# EAGLE design gps-breakout-mk-1.2 (EAGLE 7.5.0)
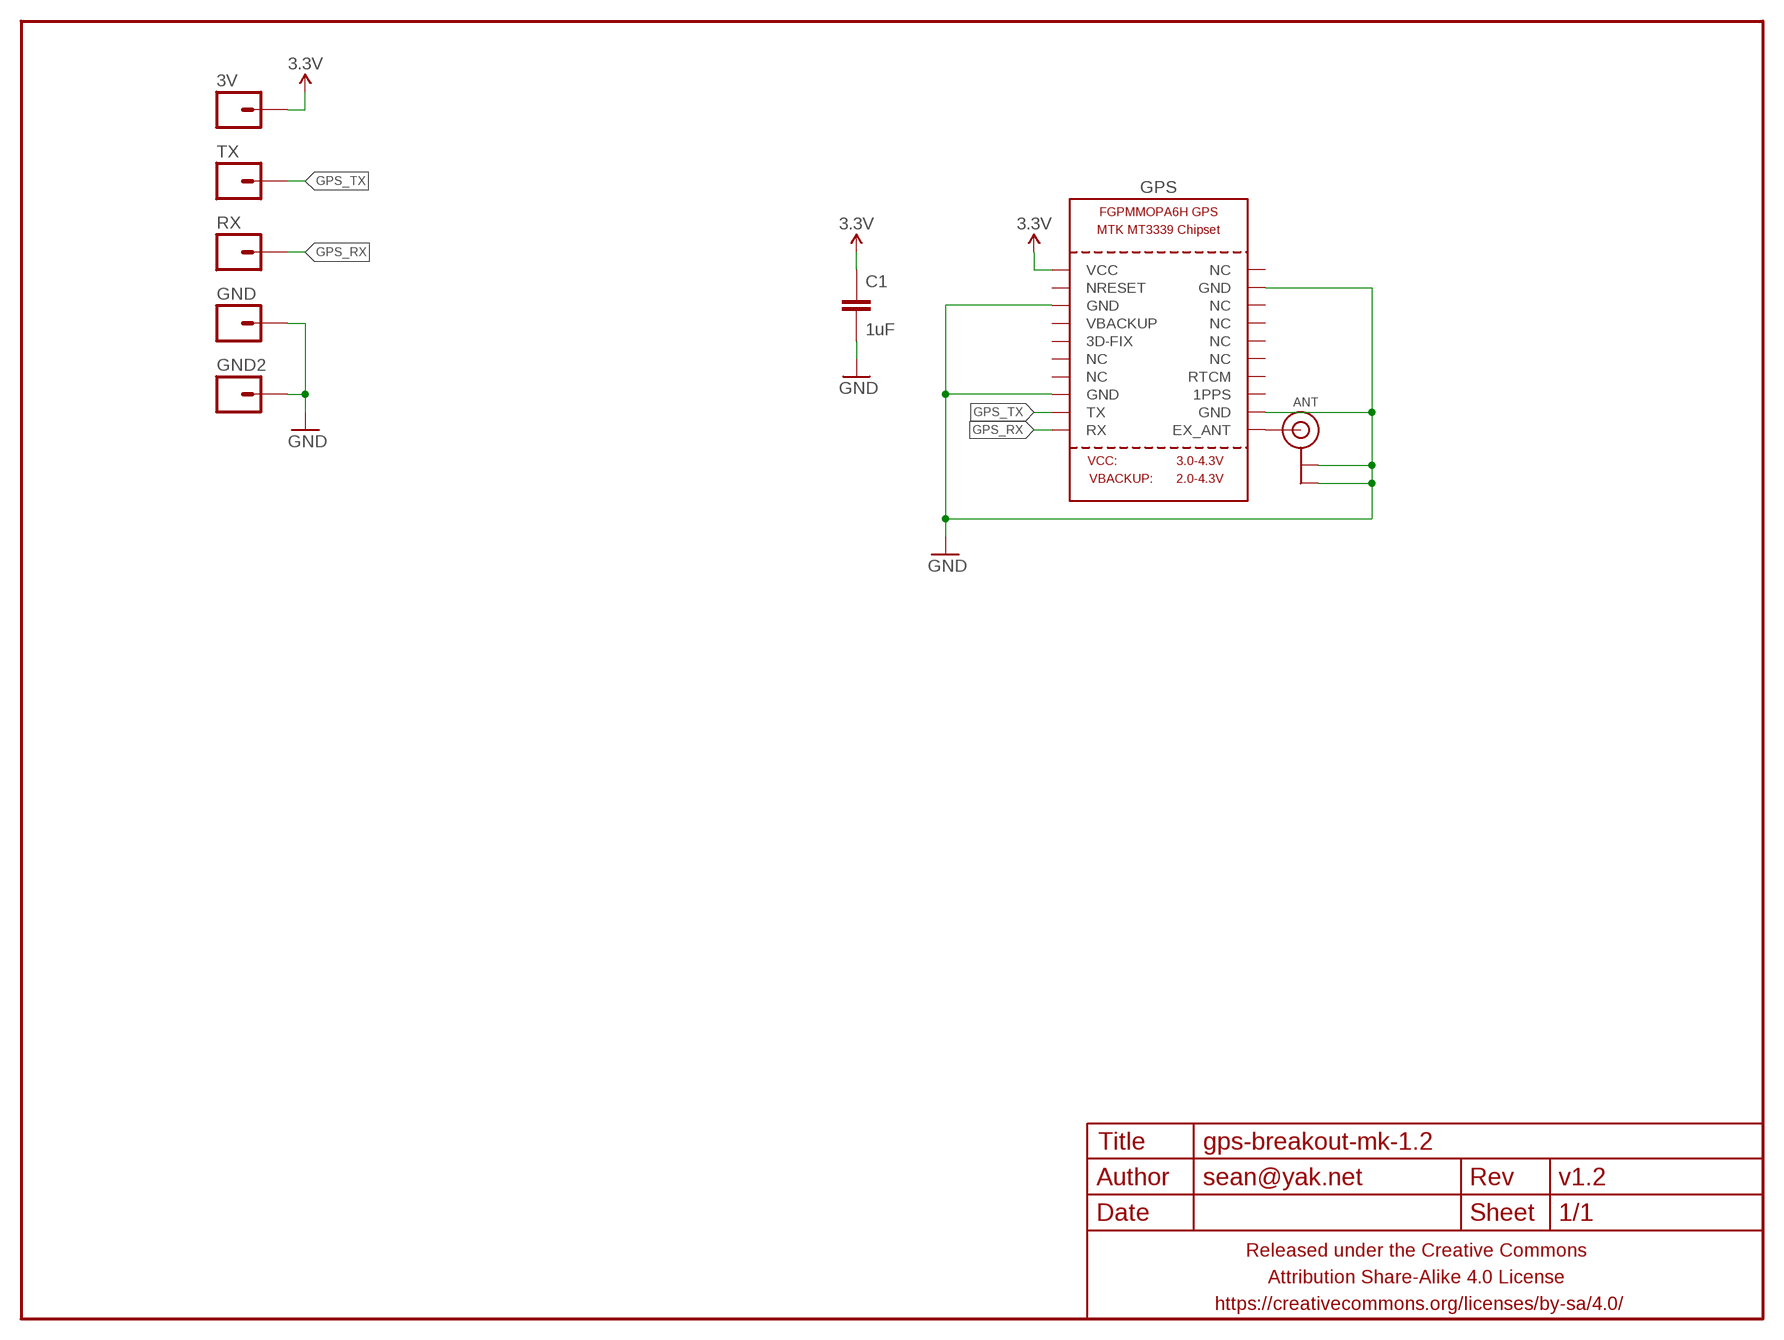
[diagram p0: schematic, sheet 1]

## Parts
3V  M01PTH-1MM  [1X01-1MM-NS]
ANT  ANTENNA_U.FL  [U.FL]
C1  1uF  CAPACITOR-CERAMICC0603-TIGHTER  [C0603-TIGHTER]
FRAME1  FRAME-LETTERNO_PACKAGE  [DUMMY]
GND  M01PTH-1MM  [1X01-1MM-NS]
GND2  M01PTH-1MM  [1X01-1MM-NS]
GPS  GPS_FGPMMOPA6H  [FGPMMOPA6H]
RX  M01PTH-1MM  [1X01-1MM-NS]
TX  M01PTH-1MM  [1X01-1MM-NS]

## Nets
3.3V: 3V.1 C1.1 GPS.P$1(VCC)
GND: ANT.1(GND) ANT.2(GND) C1.2 GND2.1 GND.1 GPS.P$3(GND) GPS.P$8(GND) GPS.P$12(GND) GPS.P$19(GND)
GPS_RX: GPS.P$10(RX) RX.1
GPS_TX: GPS.P$9(TX) TX.1
N$1: ANT.3(SIGNAL) GPS.P$11(EX_ANT)
Unconnected: GPS.P$2(NRESET) GPS.P$4(VBACKUP) GPS.P$5(3D-FIX) GPS.P$6(NC) GPS.P$7(NC) GPS.P$13(1PPS) GPS.P$14(RTCM) GPS.P$15(NC) GPS.P$16(NC) GPS.P$17(NC) GPS.P$18(NC) GPS.P$20(NC)

## Library data of the parts
3V GND GND2 RX TX = a_parts:M01: Header 1 Standard 1-pin 0.1" header. Use with straight break away headers (SKU : PRT-00116), right angle break away headers (PRT-00553), swiss pins (PRT-00743), machine pins (PRT-00117), and female headers (PRT-00115).
ANT = a_parts:ANTENNA_U.FL: U.FL Antenna Connector
C1 = a_parts:CAPACITOR-CERAMIC: CAPACITOR, European symbol
FRAME1 = a_parts:FRAME-LETTER: Schematic Frame Standard 8.5x11 US Letter frame; DESIGNER: sean@yak.net; VERSION: v1.2
GPS = a_parts:GPS_FGPMMOPA6H: GPS Module - MTK MT3339 Chipset, -165dBm sensitivity, 22 channels, 10Hz, auto-select external antenna options

## Board
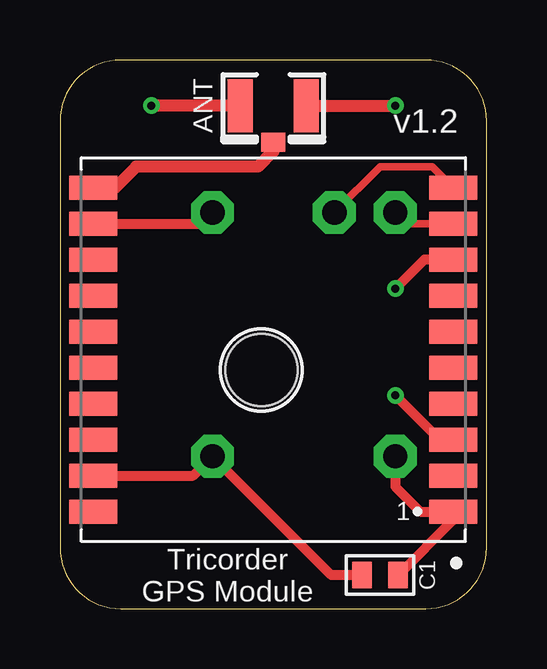
[diagram p1: board, top side]
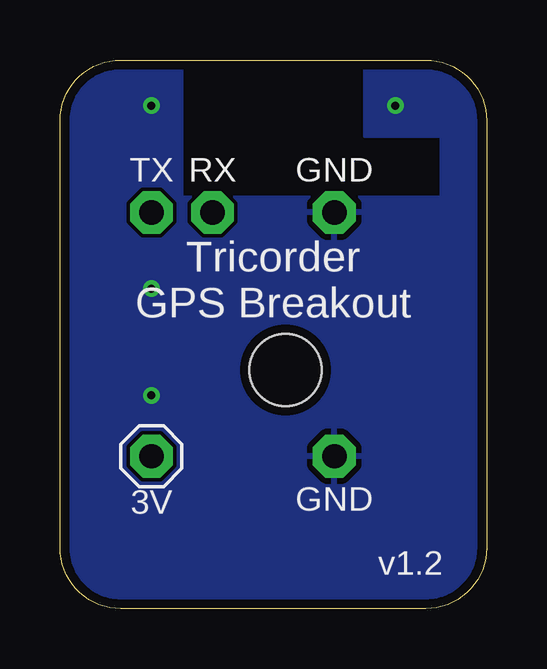
[diagram p2: board, bottom side, seen from below]

Size 17.78 x 22.86 mm. Coordinates in mm from the lower left corner, seen from the top.
Outline: 17.78,2.54 17.78,20.32 arc90 15.24,22.86 2.54,22.86 arc90 0,20.32 0,2.54 arc90 2.54,0 15.24,0 arc90 17.78,2.54
Copper layers (1*16): Top 0.0356mm / dielectric 1.5011mm / Bottom 0.0356mm
Design rules "LaenPCBOrder2": minimum track width 6mil, minimum drill 13mil, track to track 6mil, track to pad 6mil, pad to pad 6mil, via to via 6mil, smd to smd 6mil, copper to edge 15mil, drill to drill 6mil, minimum pad ring 7mil, minimum via ring 7mil, stop-mask expansion 3mil, vias tented up to drill 20mil, thermal gap 10mil

### Footprints (pad centres in the part's own frame; a part is rotated, then mirrored left to right if it is on the bottom)
1X01-1MM-NS = drill 1.016 pad 1.778 octagon: 1 0,0
U.FL = smd 2.2 x 1.05: 1 0,1.375; 2 0,-1.375 | smd 0.8 x 1: 3 1.525,0
C0603-TIGHTER = smd 0.8 x 1.1: 1 -0.75,0; 2 0.75,0
FGPMMOPA6H = smd 2 x 1: P$1 -7.5,6.75; P$2 -7.5,5.25; P$3 -7.5,3.75; P$4 -7.5,2.25; P$5 -7.5,0.75; P$6 -7.5,-0.75; P$7 -7.5,-2.25; P$8 -7.5,-3.75; P$9 -7.5,-5.25; P$10 -7.5,-6.75; P$11 7.5,-6.75; P$12 7.5,-5.25; P$13 7.5,-3.75; P$14 7.5,-2.25; P$15 7.5,-0.75; P$16 7.5,0.75; P$17 7.5,2.25; P$18 7.5,3.75; P$19 7.5,5.25; P$20 7.5,6.75 | hole 3: 0.5,0.85

### Placement (x,y rotation side)
3V  13.97,6.35 180 bottom
ANT  8.89,20.95 270 top
C1  13.34,1.4 180 top
FRAME1  0,0 0 top
GND  6.35,6.35 180 bottom
GND2  6.35,16.51 0 bottom
GPS  8.89,10.79 180 top
RX  11.43,16.51 0 bottom
TX  13.97,16.51 0 bottom

### Tracks (layer width: path | path; a pad name or v marks a point on that pad's centre or on a via)
3.3V
  Top 0.406: 3V.1 13.97,5.08 15.01,4.04 GPS.P$1 16.39,3.7 C1.1
GND  (via drill 0.33)
  Top 0.406: GPS.P$3 15.81,7.04 v13.97,8.89 | GPS.P$8 15.18,14.54 v13.97,13.34 | GPS.P$12 5.88,16.05 GND2.1 | GPS.P$19 5.54,5.54 GND.1 11.3,1.4 C1.2
  Top 0.508: ANT.2 v3.81,20.95 | ANT.1 v13.97,20.95
  pour Bottom: 12.7,22.86 15.24,22.86 arc-90 17.78,20.32 17.78,2.54 arc-90 15.24,0 2.54,0 arc-90 0,2.54 0,20.32 arc-90 2.54,22.86 5.08,22.86 5.08,19.68 1.91,19.68 1.91,17.14 12.7,17.14
GPS_RX
  Top 0.305: RX.1 13.34,18.41 15.52,18.41 GPS.P$10
GPS_TX
  Top 0.305: TX.1 14.44,16.05 GPS.P$9
N$1
  Top 0.508: GPS.P$11 2.31,17.55 3.17,18.41 8.26,18.41 8.89,19.05 ANT.3

### Text on the board
tPlace: 1 | Tricorder / GPS Module
bPlace: Tricorder / GPS Breakout
bNames: GND